# Altium schematic sheet MCU.SchDoc
size A3; DocumentNumber: 4; SheetNumber: 4; SheetTotal: 6
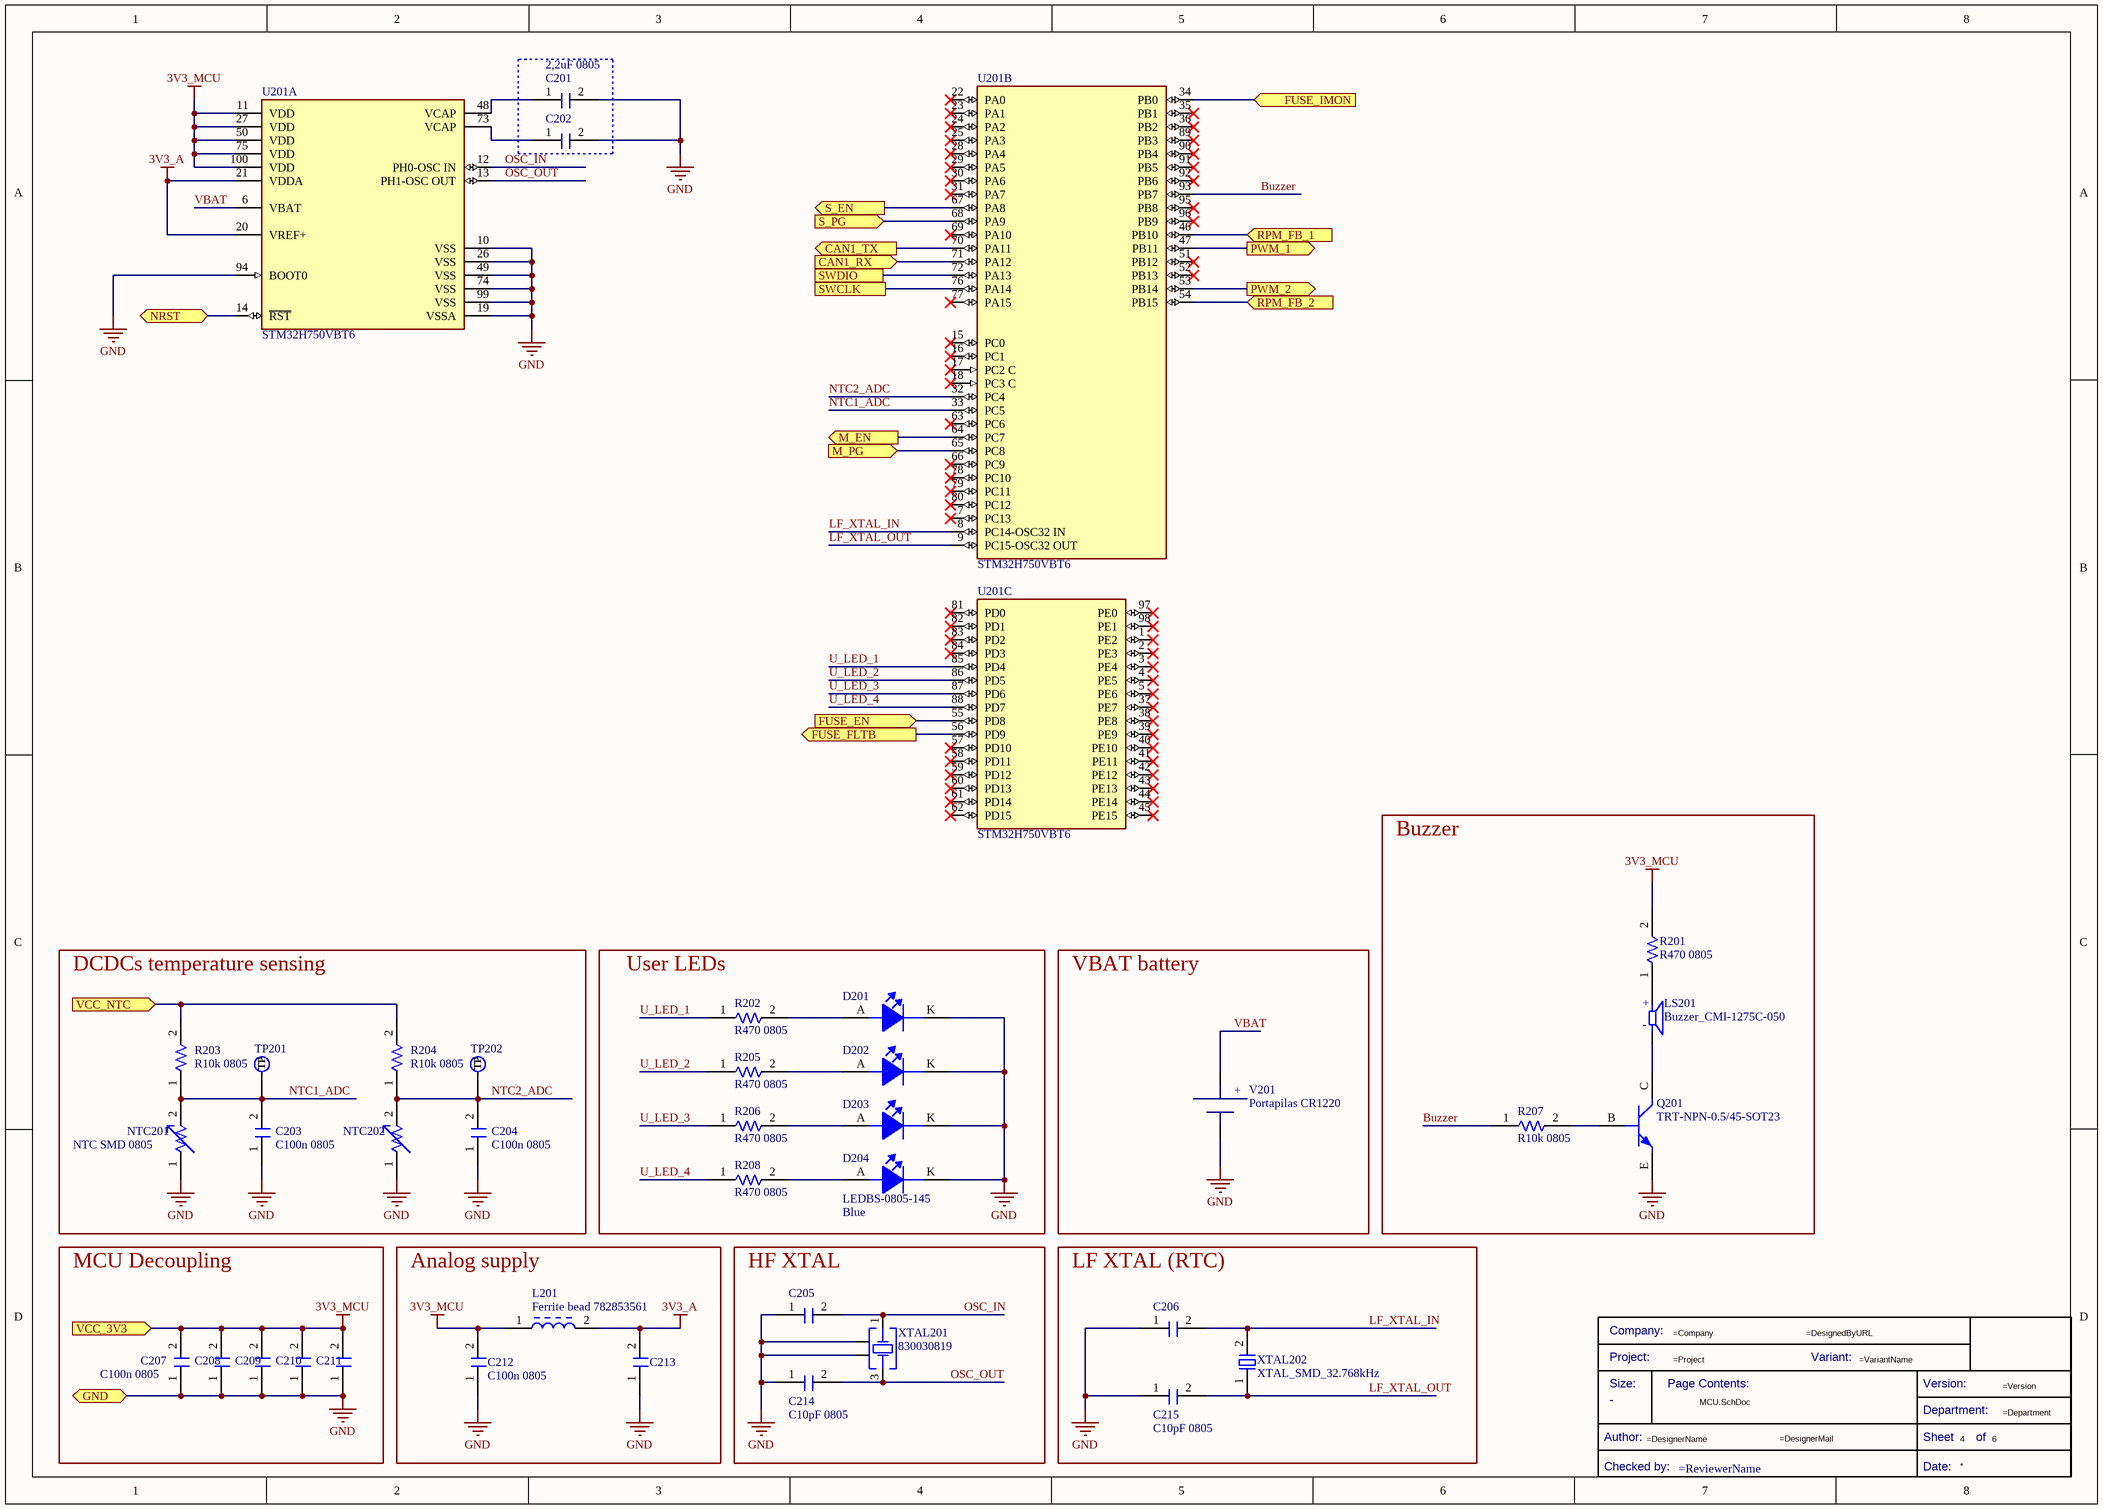
[diagram p0: MCU.SchDoc]

## Parts
*  Title Block_template  (value not drawn)  (graphical)
C201  2,2uF 0805  [C0805FNPC-W]
C202  2,2uF 0805  [C0805FNPC-W]  (value not drawn)
C203  C100n 0805  [C0805FNPC-R]
C204  C100n 0805  [C0805FNPC-R]
C205  C10pF_0805_50V  [WCAP-CSGP_0805_L2W1.25H0.6_Reflow]  (value not drawn)
C206  C10pF_0805_50V  [WCAP-CSGP_0805_L2W1.25H0.6_Reflow]  (value not drawn)
C207  C100n-50V-0805FNPC-X7R  [C0805FNPC-R]  (value not drawn)
C208  C100n-50V-0805FNPC-X7R  [C0805FNPC-R]  (value not drawn)
C209  C100n-50V-0805FNPC-X7R  [C0805FNPC-R]  (value not drawn)
C210  C100n-50V-0805FNPC-X7R  [C0805FNPC-R]  (value not drawn)
C211  C100n 0805  [C0805FNPC-R]
C212  C100n 0805  [C0805FNPC-R]
C213  C100n-50V-0805FNPC-X7R  [C0805FNPC-R]  (value not drawn)
C214  C10pF 0805  [WCAP-CSGP_0805_L2W1.25H0.6_Reflow]
C215  C10pF 0805  [WCAP-CSGP_0805_L2W1.25H0.6_Reflow]
D201  LEDBS-0805-145  [LED_0805_WE]  (value not drawn)
D202  LEDBS-0805-145  [LED_0805_WE]  (value not drawn)
D203  LEDBS-0805-145  [LED_0805_WE]  (value not drawn)
D204  LEDBS-0805-145  Color: Blue  [LED_0805_WE]
L201  Ferrite bead 782853561  [L_Ferrite_bead_0805]
LS201  Buzzer_CMI-1275C-050  [CUI_CMI-1275C-050]
NTC201  NTC SMD 0805  [RESC2012X10N]
NTC202  NTC SMD 0805  [RESC2012X10N]  (value not drawn)
Q201  TRT-NPN-0.5/45-SOT23  [TRT-NPN-0.5/45-SOT23]
R201  R470 0805  [R0805FTK]
R202  R470 0805  [R0805FTK]
R203  R10k 0805  [R0805FTK]
R204  R10k 0805  [R0805FTK]
R205  R470 0805  [R0805FTK]
R206  R470 0805  [R0805FTK]
R207  R10k 0805  [R0805FTK]
R208  R470 0805  [R0805FTK]
TP201  TestPoint  [TestPoint]  (value not drawn)  (no BOM)
TP202  TestPoint  [TestPoint]  (value not drawn)  (no BOM)
U201  STM32H750VBT6  [FP-LQFP100-1L-IPC_A]  (parts A,B,C of 3)
V201  Portapilas CR1220  [Portapilas CR1220-Footprint-1]
XTAL201  830030819  [WE-XTAL_CFPX-104]
XTAL202  XTAL_SMD_32.768kHz  [XTAL_ABS06-32.768KHZ-9-T]

## Blocks framed on the sheet
Buzzer: LS201 Q201 R201 R207
DCDCs temperature sensing: C203 C204 NTC201 NTC202 R203 R204 TP201 TP202
User LEDs: D201-D204 R202 R205 R206 R208
VBAT battery: V201
MCU Decoupling: C207-C211
Analog supply: C212 C213 L201
HF XTAL: C205 C214 XTAL201
LF XTAL (RTC): C206 C215 XTAL202

## Ports
CAN1_RX (in), CAN1_TX (out), FUSE_EN (in), FUSE_FLTB (out), FUSE_IMON (in), GND (bidir), M_EN (out), M_PG (in), NRST (bidir), PWM_1 (out), PWM_2 (out), RPM_FB_1 (in), RPM_FB_2 (in), S_EN (out), S_PG (in), SWCLK, SWDIO, VCC_3V3 (in), VCC_NTC (in)

## Nets
3V3_A: C213.2 L201.2 U201.20(VREF+) U201.21(VDDA)
3V3_MCU: C207.2 C208.2 C209.2 C210.2 C211.2 C212.2 L201.1 R201.2 U201.11(VDD) U201.27(VDD) U201.50(VDD) U201.75(VDD) U201.100(VDD) ; port VCC_3V3
GND: C201.2 C202.2 C203.1 C204.1 C205.1 C206.1 C207.1 C208.1 C209.1 C210.1 C211.1 C212.1 C213.1 C214.1 C215.1 D201.K D202.K D203.K D204.K NTC201.1 NTC202.1 Q201.E U201.10(VSS) U201.19(VSSA) U201.26(VSS) U201.49(VSS) U201.74(VSS) U201.94(BOOT0) U201.99(VSS) V201.2(GND) XTAL201.2(GND_&_Lid) XTAL201.4(GND_&_Lid) ; port GND
Buzzer: R207.1 U201.93(PB7)
CAN1_RX: U201.71(PA12) ; port CAN1_RX
CAN1_TX: U201.70(PA11) ; port CAN1_TX
FUSE_EN: U201.55(PD8) ; port FUSE_EN
FUSE_FLTB: U201.56(PD9) ; port FUSE_FLTB
FUSE_IMON: U201.34(PB0) ; port FUSE_IMON
LF_XTAL_IN: C206.2 U201.8(PC14-OSC32_IN) XTAL202.2
LF_XTAL_OUT: C215.2 U201.9(PC15-OSC32_OUT) XTAL202.1
M_EN: U201.64(PC7) ; port M_EN
M_PG: U201.65(PC8) ; port M_PG
NRST: U201.14(~{RST}) ; port NRST
NTC1_ADC: C203.2 NTC201.2 R203.1 TP201.1(TP) U201.33(PC5)
NTC2_ADC: C204.2 NTC202.2 R204.1 TP202.1(TP) U201.32(PC4)
OSC_IN: C205.2 U201.12(PH0-OSC_IN) XTAL201.1(Crystal)
OSC_OUT: C214.2 U201.13(PH1-OSC_OUT) XTAL201.3(Crystal)
PWM_1: U201.47(PB11) ; port PWM_1
PWM_2: U201.53(PB14) ; port PWM_2
RPM_FB_1: U201.46(PB10) ; port RPM_FB_1
RPM_FB_2: U201.54(PB15) ; port RPM_FB_2
S_EN: U201.67(PA8) ; port S_EN
S_PG: U201.68(PA9) ; port S_PG
SWCLK: U201.76(PA14) ; port SWCLK
SWDIO: U201.72(PA13) ; port SWDIO
U_LED_1: R202.1 U201.85(PD4)
U_LED_2: R205.1 U201.86(PD5)
U_LED_3: R206.1 U201.87(PD6)
U_LED_4: R208.1 U201.88(PD7)
VBAT: U201.6(VBAT) V201.1(V+)
VCC_NTC: R203.2 R204.2 ; port VCC_NTC
NetC201_1: C201.1 U201.48(VCAP)
NetC202_1: C202.1 U201.73(VCAP)
NetD201_A: D201.A R202.2
NetD202_A: D202.A R205.2
NetD203_A: D203.A R206.2
NetD204_A: D204.A R208.2
NetLS201_N: LS201.N Q201.C
NetLS201_P: LS201.P R201.1
NetQ201_B: Q201.B R207.2

Not connected (* = marked no-connect by the designer): U201 1(PE2)* 2(PE3)* 3(PE4)* 4(PE5)* 5(PE6)* 7(PC13)* 15(PC0)* 16(PC1)* 17(PC2_C)* 18(PC3_C)* 22(PA0)* 23(PA1)* 24(PA2)* 25(PA3)* 28(PA4)* 29(PA5)* 30(PA6)* 31(PA7)* 35(PB1)* 36(PB2)* 37(PE7)* 38(PE8)* 39(PE9)* 40(PE10)* 41(PE11)* 42(PE12)* 43(PE13)* 44(PE14)* 45(PE15)* 51(PB12)* 52(PB13)* 57(PD10)* 58(PD11)* 59(PD12)* 60(PD13)* 61(PD14)* 62(PD15)* 63(PC6)* 66(PC9)* 69(PA10)* 77(PA15)* 78(PC10)* 79(PC11)* 80(PC12)* 81(PD0)* 82(PD1)* 83(PD2)* 84(PD3)* 89(PB3)* 90(PB4)* 91(PB5)* 92(PB6)* 95(PB8)* 96(PB9)* 97(PE0)* 98(PE1)*

## Notes on the sheet
- (in symbol CMP-003-00001-1) +; -
- (in symbol CMP-00028-00008-3) +
- (in symbol Title Block_template) Company:; Project:; Variant:; Size:; Page Contents:; Version:; Department:; Author:; Sheet; of; Checked by:; Date:

## Library data of the parts
* = Title Block_template: Standard Title Block; .Creator: GP; Category: Title Block; .PCBcheck: GP; .SCHcheck: GP; Checked by:: =ReviewerName; Size: -
C201 C202 = CMP-00058-1: Multilayer Ceramic Capacitor, Wcap-Csgp Series, 22 F, 20%, X5R, 10 V, 0805 [2012 Metric] Rohs Compliant: Yes; Manufacturer: Wurth Electronics; Manufacturer Part Number: 885012107011; Value: 22µF; Voltage Rating (DC): 10V; .Creator: DR; Length: 0.079inch; ComponentLink3URL: http://www.farnell.com/datasheets/1958453.pdf?src-supplier=Element14; ComponentLink1Description: http://www.farnell.com/datasheets/1958453.pdf?src-supplier=Farnell; ComponentLink2Description: http://www.farnell.com/datasheets/1958453.pdf?src-supplier=Newark; Dielectric: X5R; ComponentLink5Description: Where buy it; Thickness: 0.057inch; Min Operating Temperature: -55°C; RoHS Compliant: Yes; ComponentLink2URL: http://www.farnell.com/datasheets/1958453.pdf?src-supplier=Newark; Case Code (Metric): 2012; Tolerance: 20%; ComponentLink5URL: https://www.we-online.com/catalog/en/WCAP-CSGP-10VDC#885012107011; Source: Passives.SchLib; ComponentLink1URL: http://www.farnell.com/datasheets/1958453.pdf?src-supplier=Farnell; Category: Ceramic Capacitors; ComponentLink4URL: https://katalog.we-online.de/pbs/datasheet/885012107011.pdf?src-supplier=Digi-Key; RoHS: Yes; ComponentLink4Description: https://katalog.we-online.de/pbs/datasheet/885012107011.pdf?src-supplier=Digi-Key; Design Item ID: C22u-10V-0805FNPC-X5R; ComponentLink3Description: http://www.farnell.com/datasheets/1958453.pdf?src-supplier=Element14; Mount: Surface Mount; REACH SVHC: Unknown; Width: 0.049inch; Max Operating Temperature: 85°C; Case/Package: 0805; Stock 1: 8800; Pricing 1: 20=0,15300, 100=0,40300, 200=0,37700, 500=0,35100, 1000=0,31700 (GBP); Voltage Rating: 10V; Packaging: Cut Tape
C203 C204 C207-C213 = CMP-00063-1: Cap, 0.1ΜF, 50V, 10%, X7R, 0805; Manufacturer 1: Wurth Electronics; Manufacturer Part Number 1: 885012207098; Value: 100nF; .Creator: DR; Pricing 1: 100=0,10200, 500=0,07100, 2000=0,06100 (GBP); ComponentLink1URL: http://www.farnell.com/datasheets/1958498.pdf?src-supplier=Farnell; Design Item ID: C100n-50V-0805FNPC-X7R; Voltage Rating (DC): 50V; Voltage Rating: 50V; Max Operating Temperature: 125°C; RoHS: Yes; Case Code (Metric): 2012; Mount: Surface Mount; REACH SVHC: Unknown; Stock 1: 8000; Source: Passives.SchLib; Tolerance: 10%; RoHS Compliant: Yes; Dielectric: X7R; ComponentLink2Description: http://www.farnell.com/datasheets/1958498.pdf?src-supplier=Element14; ComponentLink2URL: http://www.farnell.com/datasheets/1958498.pdf?src-supplier=Element14; Min Operating Temperature: -55°C; Width: 0.049inch; Category: Ceramic Capacitors; Thickness: 0.035inch; Length: 0.079inch; ComponentLink3URL: https://katalog.we-online.de/pbs/datasheet/885012207098.pdf?src-supplier=Digi-Key; Case/Package: 0805; ComponentLink3Description: https://katalog.we-online.de/pbs/datasheet/885012207098.pdf?src-supplier=Digi-Key; Packaging: Cut Tape; ComponentLink1Description: http://www.farnell.com/datasheets/1958498.pdf?src-supplier=Farnell; ComponentLink4Description: http://www.farnell.com/datasheets/1958498.pdf?src-supplier=Newark; ComponentLink4URL: http://www.farnell.com/datasheets/1958498.pdf?src-supplier=Newark
C205 C206 C214 C215 = CMP-001-00012-2: Ceramic Capacitor, Multilayer, Ceramic, 50V, 5% +Tol, 5% -Tol, C0G, 30ppm/Cel TC, 0.00001uF, Surface Mount, 0805. 885012007051; Pins: 2; RoHS Compliant: Yes; Capacitor Type: Ceramic
D201-D204 = CMP-00129-1: LED BLUE CLEAR 0805 SMD; Manufacturer 1: Wurth Electronics; Manufacturer Part Number 1: 150080BS75000; Lens Style: Clear,Rectangular; Wavelength: 470nm; Forward Voltage: 3.2V; Viewing Angle: 140°; .Creator: GP; Test Current: 20mA; Forward Current: 30mA; Luminous Intensity: 145mcd; ComponentLink2Description: Where buy it; Length: 2mm; RoHS Compliant: Yes; ComponentLink3URL: https://datasheet.ciiva.com/23843/150080bs75000-23843251.pdf?src-supplier=Newark; Min Operating Temperature: -40°C; Stock 1: 7400; Lead Free: Lead Free; Height: 0.7mm; ComponentLink7URL: https://datasheet.ciiva.com/29562/150080bs75000-29562923.pdf?src-supplier=Digi-Key; Case Code (Imperial): 0805; Category: LEDs; Pricing 1: 50=0,19300, 500=0,12900, 1000=0,12200, 2000=0,11700, 4000=0,11100 (USD); ComponentLink4Description: https://datasheet.ciiva.com/22656/1740214-22656954.pdf?src-supplier=Element14; ComponentLink4URL: https://datasheet.ciiva.com/22656/1740214-22656954.pdf?src-supplier=Element14; Packaging: Tape and Reel; ComponentLink1URL: https://www.we-online.com/catalog/datasheet/150080BS75000.pdf; Case/Package: 0805; Mount: Surface Mount; ComponentLink5URL: https://datasheet.ciiva.com/29279/759433-da-01-en-chipled-0805-w-kl-blau-150080bs75000-29279203.pdf?src-supplier=Conrad; ComponentLink1Description: Datasheet; ComponentLink6URL: https://datasheet.ciiva.com/29562/150080bs75000-29562922.pdf?src-supplier=Digi-Key; Dominant Wavelength: 470nm; REACH SVHC: Unknown; Width: 1.25mm; RoHS: Yes; Design Item ID: LEDBS-0805-145; ComponentLink7Description: https://datasheet.ciiva.com/29562/150080bs75000-29562923.pdf?src-supplier=Digi-Key; ComponentLink2URL: https://katalog.we-online.de/en/led/WL-SMCW/150080BS75000; ComponentLink6Description: https://datasheet.ciiva.com/29562/150080bs75000-29562922.pdf?src-supplier=Digi-Key; Max Operating Temperature: 85°C; ComponentLink3Description: https://datasheet.ciiva.com/23843/150080bs75000-23843251.pdf?src-supplier=Newark; Source: Semiconductor.SchLib; Case Code (Metric): 2012; Package Quantity: 4000; ComponentLink5Description: https://datasheet.ciiva.com/29279/759433-da-01-en-chipled-0805-w-kl-blau-150080bs75000-29279203.pdf?src-supplier=Conrad
  D201-D203: Color: Blue
L201 = CMP-00166-1: Manufacturer Part Number: BLM18EG331TN1D; Manufacturer: Murata; .Creator: GP; Tolerance: 25%; Impedance: 330R; Max DC Current: 500mA; Resistance: 0.21; Number of Circuits: 1; DC Resistance (DCR): 210mR; Material: Ferrite,Steel; Test Frequency: 100MHz; RoHS: Yes; Case Code (Metric): 1608; ComponentLink6URL: https://datasheet.ciiva.com/3082/l0110s0101blm18e-3082714.pdf?src-supplier=Avnet; ComponentLink7URL: https://datasheet.ciiva.com/6211/l0110s0101blm18e-6211470.pdf?src-supplier=Digi-Key; Width: 0.8mm; ComponentLink6Description: https://datasheet.ciiva.com/3082/l0110s0101blm18e-3082714.pdf?src-supplier=Avnet; Series: BLM18E; Stock 1: 20037; Core Material: Ferrite; Packaging: Tape and Reel; Max Operating Temperature: 125°C; Case/Package: 0603; ComponentLink8URL: https://datasheet.ciiva.com/6211/l0110s0101blm18e-6211471.pdf?src-supplier=Digi-Key; Case Code (Imperial): 0603; Lead Free: Lead Free; ComponentLink3Description: https://datasheet.ciiva.com/41449/001172267-da-01-en-drossel-0603-330r-1-6x0-8mm-4000st-41449581.pdf?src-supplier=Conrad; Height: 0.8mm; REACH SVHC: No SVHC; ComponentLink1URL: https://datasheet.ciiva.com/1467/5169-1467232.pdf?src-supplier=Element14; Number of Pins: 2; Source: Filter components.SchLib; ComponentLink1Description: https://datasheet.ciiva.com/1467/5169-1467232.pdf?src-supplier=Element14; Depth: 0.8mm; Termination: SMD/SMT; Package Quantity: 1; Min Operating Temperature: -55°C; ComponentLink7Description: https://datasheet.ciiva.com/6211/l0110s0101blm18e-6211470.pdf?src-supplier=Digi-Key; Design Item ID: L_Ferrite_bead_782853561; Length: 1.6mm; ComponentLink4Description: https://datasheet.ciiva.com/1467/5169-1467233.pdf?src-supplier=Element14; ComponentLink8Description: https://datasheet.ciiva.com/6211/l0110s0101blm18e-6211471.pdf?src-supplier=Digi-Key; Current Rating: 500mA; RoHS Compliant: Yes; ComponentLink2Description: https://datasheet.ciiva.com/11795/0900766b811b5866-11795405.pdf?src-supplier=RSComponents; Number of Lines: 1; ComponentLink2URL: https://datasheet.ciiva.com/11795/0900766b811b5866-11795405.pdf?src-supplier=RSComponents; Pricing 1: 1=0,23000, 10=0,17500, 25=0,14520, 50=0,12520, 100=0,11260, 250=0,09508, 500=0,08508, 1000=0,07257 (USD); Max Current Rating: 500mA; ComponentLink5URL: https://datasheet.ciiva.com/1561/5169-1561345.pdf?src-supplier=Newark; ComponentLink4URL: https://datasheet.ciiva.com/1467/5169-1467233.pdf?src-supplier=Element14; Category: Ferrite Beads and Chips; ComponentLink3URL: https://datasheet.ciiva.com/41449/001172267-da-01-en-drossel-0603-330r-1-6x0-8mm-4000st-41449581.pdf?src-supplier=Conrad; ComponentLink5Description: https://datasheet.ciiva.com/1561/5169-1561345.pdf?src-supplier=Newark
LS201 = CMP-003-00001-1: 12 mm, 5 Vdc, 90 dB, 3.1 kHz, Through Hole, Magnetic Audio Indicator Buzzer; Value: 0µH; MF: CUI Devices; Case/Package: TO-220 CUI Inc.; Mouser-Purchase-URL: https://snapeda.com/shop?store=Mouser&id=2772244; CUI_purchase_URL: https://www.cuidevices.com/product/audio/buzzers/audio-indicators/cmi-1275c-050?utm_source=snapeda.com&utm_medium=referral&utm_campaign=snapedaBOM; Price: None; Design Item ID: Buzzer_CMI-1275C-050; Availability: Unavailable; Source: CommonFiles_Library.SchLib; SnapEDA_Link: https://www.snapeda.com/parts/CMI-1275C-050/CUI%20Devices/view-part/2772244/?ref=snap; MP: CMI-1275C-050; DigiKey-Purchase-URL: https://snapeda.com/shop?store=DigiKey&id=2772244
NTC201 NTC202 = CMP-010-00001-1: NTC 0805 package 10kR
Q201 = CMP-00148-1: ON Semi BC817-25LT1G NPN Bipolar Transistor; 0.5 A; 45 V; 3-Pin SOT-23; Current Rating: 500mA; Collector-emitter Voltage-Max: 700mV; Gain Bandwidth Product: 100MHz; Element Configuration: Single; hFE Min: 160; Collector Emitter Voltage (VCEO): 45V; Emitter Base Voltage (VEBO): 5V; Collector Base Voltage (VCBO): 50V; Power Dissipation: 300mW; .Creator: GP; Number of Elements: 1; ComponentLink2URL: *; Packaging: *; ComponentLink14Description: https://datasheet.ciiva.com/976/bc817-16lt1-d-976357.pdf?src-supplier=Digi-Key; Radiation Hardening: No; Pricing 1: 1=0,20000, 10=0,18500, 100=0,10080, 500=0,06204, 1000=0,04229 (USD); ComponentLink9URL: https://datasheet.ciiva.com/4722/bc817-16lt1-d-104560-4722229.pdf?src-supplier=Mouser; Vce max: *; Gain: *; Max Power Dissipation: *; ComponentLink5URL: https://datasheet.ciiva.com/1196/bc817-16lt1-d-1196558.pdf?src-supplier=Element14; ComponentLink16URL: https://datasheet.ciiva.com/976/bc817-16lt1-d-976356.pdf?src-supplier=Digi-Key; Contact Plating: Tin,Matte; Max Operating Temperature: *; Package: *; Width: 1.3mm; ComponentLink2Description: Where buy it; ComponentLink15URL: https://datasheet.ciiva.com/976/bc817-16lt1-d-976358.pdf?src-supplier=Digi-Key; Package Quantity: 1; RoHS: *; Collector Emitter Saturation Voltage: 700mV; Transition Frequency: 100MHz; ComponentLink7URL: https://datasheet.ciiva.com/22664/bc817-16lt1-d-22664204.pdf?src-supplier=Element14; ComponentLink10URL: https://datasheet.ciiva.com/1195/bc817-16lt1-d-1195763.pdf?src-supplier=Element14; Design Item ID: TRT-NPN-0.5/45-SOT23; Series: -; ComponentLink8URL: https://datasheet.ciiva.com/22664/1842041-22664101.pdf?src-supplier=Element14; Lead Free: Lead Free; ComponentLink4Description: https://datasheet.ciiva.com/15138/getdatasheetpartid-38405-15138602.pdf?src-supplier=Verical; ComponentLink12Description: https://datasheet.ciiva.com/11197/bc817-16lt1-d-11197514.pdf?src-supplier=Avnet; ComponentLink11Description: https://datasheet.ciiva.com/1195/bc817-16lt1-d-1195764.pdf?src-supplier=Element14; Max Frequency: 100MHz; ComponentLink13URL: https://datasheet.ciiva.com/25996/bc817-16lt1-d-25996327.pdf?src-supplier=Avnet+Europe; Max Breakdown Voltage: 45V; Polarity: *; ComponentLink6URL: https://datasheet.ciiva.com/22641/bc817-16lt1-d-22641013.pdf?src-supplier=Farnell; ComponentLink4URL: https://datasheet.ciiva.com/15138/getdatasheetpartid-38405-15138602.pdf?src-supplier=Verical; Height: 0.94mm; Power rating: *; Source: Semiconductor.SchLib; Max Collector Current: 500mA; ComponentLink15Description: https://datasheet.ciiva.com/976/bc817-16lt1-d-976358.pdf?src-supplier=Digi-Key; ComponentLink11URL: https://datasheet.ciiva.com/1195/bc817-16lt1-d-1195764.pdf?src-supplier=Element14; REACH SVHC: No SVHC; Number of Pins: 3; Manufacturer Part Number: *; Case/Package: SOT-23-3; ComponentLink1Description: Datasheet; RoHS Compliant: Yes; Collector Emitter Breakdown Voltage: 45V; Halogen Free: Halogen Free; Frequency: 100MHz; ComponentLink3Description: https://datasheet.ciiva.com/27748/2010413-27748829.pdf?src-supplier=Jameco; ComponentLink3URL: https://datasheet.ciiva.com/27748/2010413-27748829.pdf?src-supplier=Jameco; ComponentLink9Description: https://datasheet.ciiva.com/4722/bc817-16lt1-d-104560-4722229.pdf?src-supplier=Mouser; Category: Transistor; Type: *; ComponentLink8Description: https://datasheet.ciiva.com/22664/1842041-22664101.pdf?src-supplier=Element14; ComponentLink10Description: https://datasheet.ciiva.com/1195/bc817-16lt1-d-1195763.pdf?src-supplier=Element14; ComponentLink1URL: *; ComponentLink16Description: https://datasheet.ciiva.com/976/bc817-16lt1-d-976356.pdf?src-supplier=Digi-Key; Manufacturer: *; ComponentLink12URL: https://datasheet.ciiva.com/11197/bc817-16lt1-d-11197514.pdf?src-supplier=Avnet; ComponentLink6Description: https://datasheet.ciiva.com/22641/bc817-16lt1-d-22641013.pdf?src-supplier=Farnell; ComponentLink13Description: https://datasheet.ciiva.com/25996/bc817-16lt1-d-25996327.pdf?src-supplier=Avnet+Europe; Ic max: *; ComponentLink14URL: https://datasheet.ciiva.com/976/bc817-16lt1-d-976357.pdf?src-supplier=Digi-Key; Length: 2.9mm; ComponentLink5Description: https://datasheet.ciiva.com/1196/bc817-16lt1-d-1196558.pdf?src-supplier=Element14; Min Operating Temperature: *; ComponentLink7Description: https://datasheet.ciiva.com/22664/bc817-16lt1-d-22664204.pdf?src-supplier=Element14
R201 R202 R205 R206 R208 = CMP-00093-1: Res Thick Film 0805 470 Ohm 1% 1/8W ±100ppm/°C Molded SMD SMD Paper Tape on Plastic Reel; Manufacturer 1: Bourns; Manufacturer Part Number 1: CR0805-FX-4700GLF; Max Power Dissipation: 125mW; Voltage Rating: 150V; Value: 470; .Creator: DR; Min Operating Temperature: -55°C; Mount: Surface Mount; Series: CR0805; Termination: SMD/SMT; REACH SVHC: No SVHC; Depth: 1.25mm; RoHS: Yes; ComponentLink3Description: https://datasheet.ciiva.com/22693/1902866-22693247.pdf?src-supplier=Element14; Max Operating Temperature: 155°C; ComponentLink2Description: https://datasheet.ciiva.com/7985/1856384-7985880.pdf?src-supplier=Element14; Resistor Type: Thick Film; Construction: Rectangular; Number of Terminations: 2; Pins: 2; Length: 2mm; Case Code (Metric): 2012; Category: Chip SMD Resistors; Design Item ID: R470-0805FTK; ComponentLink4Description: https://datasheet.ciiva.com/5541/chpreztr-5541930.pdf?src-supplier=Mouser; Pricing 1: 1=0,00990, 10=0,00980, 25=0,00950, 50=0,00940, 100=0,00930, 250=0,00920, 500=0,00910, 1000=0,00890, 3000=0,00870, 6000=0,00860 (USD); ComponentLink4URL: https://datasheet.ciiva.com/5541/chpreztr-5541930.pdf?src-supplier=Mouser; Tolerance: 1%; Technology: THICK FILM; Packaging: Tape and Reel; Military Standard: Not; Temperature Coefficient: 100ppm/°C; Height: 0.5mm; Thickness: 508um; Stock 1: 12623; Contact Plating: Tin; Case/Package: 0805; Features: Moisture Resistant; ComponentLink1Description: https://datasheet.ciiva.com/11808/0900766b80fcdb72-11808686.pdf?src-supplier=RSComponents; ComponentLink3URL: https://datasheet.ciiva.com/22693/1902866-22693247.pdf?src-supplier=Element14; Voltage Rating (DC): 150V; Power Rating: 125mW; ComponentLink1URL: https://datasheet.ciiva.com/11808/0900766b80fcdb72-11808686.pdf?src-supplier=RSComponents; Resistance Tolerance: 1%; ComponentLink2URL: https://datasheet.ciiva.com/7985/1856384-7985880.pdf?src-supplier=Element14; Radiation Hardening: No; Source: Passives.SchLib
R203 R204 R207 = CMP-00085-1: BOURNS         CR0805-JW-103ELF            Surface Mount Chip Resistor, Thick Film, CR Series, 10 kohm, 125 mW,  5%, 150 V; .Creator: DR; Power Rating: 125mW; Voltage Rating (DC): 100V; Voltage Rating: 150V; Temperature Coefficient: 200ppm/°C; Value: 10k; ComponentLink6URL: https://datasheet.ciiva.com/16783/70154685-16783482.pdf?src-supplier=Allied+Electronics; Manufacturer 1: Bourns; Package Quantity: 1; ComponentLink10URL: https://datasheet.ciiva.com/7985/1856384-7985869.pdf?src-supplier=Element14; Technology: THICK FILM; Source: Passives.SchLib; RoHS Compliant: Yes; ComponentLink10Description: https://datasheet.ciiva.com/7985/1856384-7985869.pdf?src-supplier=Element14; ComponentLink1URL: https://datasheet.ciiva.com/11821/0900766b80fcdb72-11821135.pdf?src-supplier=RSComponents; ComponentLink7Description: https://datasheet.ciiva.com/5548/chpreztr-5548491.pdf?src-supplier=Mouser; Radiation Hardening: No; Design Item ID: R10k-0805FTK; ComponentLink4Description: https://datasheet.ciiva.com/7986/691949-7986187.pdf?src-supplier=Element14; Pins: 2; ComponentLink9URL: https://datasheet.ciiva.com/6559/chpreztr-6559901.pdf?src-supplier=Digi-Key; Resistor Type: Thick Film; ComponentLink4URL: https://datasheet.ciiva.com/7986/691949-7986187.pdf?src-supplier=Element14; Contact Plating: Tin; Case Code (Metric): 2012; Military Standard: Not; Depth: 1.25mm; Case/Package: 0805; Packaging: Tape and Reel; ComponentLink9Description: https://datasheet.ciiva.com/6559/chpreztr-6559901.pdf?src-supplier=Digi-Key; Construction: Rectangular; Pricing 1: 1=0,05790, 10=0,01540, 25=0,01340, 100=0,00340 (USD); ComponentLink7URL: https://datasheet.ciiva.com/5548/chpreztr-5548491.pdf?src-supplier=Mouser; Category: Chip SMD Resistors; Length: 2mm; Max Operating Temperature: 155°C; Resistance Tolerance: 5%; Manufacturer Part Number 1: CR0805-JW-103ELF; Height: 0.5mm; ComponentLink2URL: https://datasheet.ciiva.com/9122/chpreztr-9122374.pdf?src-supplier=Avnet; Thickness: 508um; Max Power Dissipation: 125mW; ComponentLink8Description: https://datasheet.ciiva.com/6559/chpreztr-6559900.pdf?src-supplier=Digi-Key; REACH SVHC: No SVHC; ComponentLink8URL: https://datasheet.ciiva.com/6559/chpreztr-6559900.pdf?src-supplier=Digi-Key; ComponentLink5URL: https://datasheet.ciiva.com/30065/159chpreztr-30065976.pdf?src-supplier=Onlinecomponents.com; Width: 1.25mm; ComponentLink11URL: https://datasheet.ciiva.com/48692/001055517-da-01-en-smd-wid-cr0805-jw-103elf-10k-ohm-1-8w-48692118.pdf?src-supplier=Conrad; ComponentLink3Description: https://datasheet.ciiva.com/22693/1902866-22693254.pdf?src-supplier=Element14; ComponentLink11Description: https://datasheet.ciiva.com/48692/001055517-da-01-en-smd-wid-cr0805-jw-103elf-10k-ohm-1-8w-48692118.pdf?src-supplier=Conrad; ComponentLink1Description: https://datasheet.ciiva.com/11821/0900766b80fcdb72-11821135.pdf?src-supplier=RSComponents; ComponentLink2Description: https://datasheet.ciiva.com/9122/chpreztr-9122374.pdf?src-supplier=Avnet; Stock 1: 57566; Min Operating Temperature: -55°C; Series: CR0805; Number of Terminations: 2; Termination: SMD/SMT; Tolerance: 5%; Mount: Surface Mount; ComponentLink6Description: https://datasheet.ciiva.com/16783/70154685-16783482.pdf?src-supplier=Allied+Electronics; ComponentLink5Description: https://datasheet.ciiva.com/30065/159chpreztr-30065976.pdf?src-supplier=Onlinecomponents.com; RoHS: Yes; Features: Moisture Resistant; ComponentLink3URL: https://datasheet.ciiva.com/22693/1902866-22693254.pdf?src-supplier=Element14
TP201 TP202 = CMP-00042-1: Test Point 1x1 mm; .SCHcheck: GP; Category: TestPoint; Source: e-Tech_Racing.SchLib; .Creator: GP; .PCBcheck: GP; Design Item ID: TestPoint
U201 = CMP-031-00006-1: RISC Microcontroller, 32-Bit, FLASH, 400MHz, CMOS, PQFP100; RoHS Compliant: Yes
V201 = CMP-00028-00008-3: 237-8301 Portapilas para 1 pila CR1220, montaje Montaje superficial
XTAL201 = CMP-003-00000-1: WE-XTAL Quartz Crystal, SMT, CFPX-104, 16MHz, +/-50ppm; Manufacturer: Wurth Elektronik; Load Capacitance: 18pF; ComponentLink2Description: Datasheet Link; Manufacturer Part Number: 830030819; Match Code: WE-XTAL; ComponentLink1Description: Website Link; Width: 3.2mm; Source: WE-XTAL.SchLib; Category: Crystals; Mount: Surface Mount; Frequency: 16MHz; Operating Temperature Max: 60°C; Frequency Tolerance: +/-50ppm; Pins: 4; Design Item ID: 830030819; Component Type: Standard; Length: 5mm; Height: 1mm; Frequency Stability: +/-50ppm; Operating Temperature Min: -10°C; ComponentLink2URL: https://www.we-online.com/redexpert/spec/830030819?ad; ComponentLink1URL: https://www.we-online.com/redexpert/article/830030819?ad; Packaging: Tape and Reel; Case/Package: CFPX-104
XTAL202 = CMP-105-000000-1: Design Item ID: XTAL_SMD_32.768kHz; Source: CommonFiles_Library.SchLib